# EAGLE schematic uart (EAGLE 7.6.0)
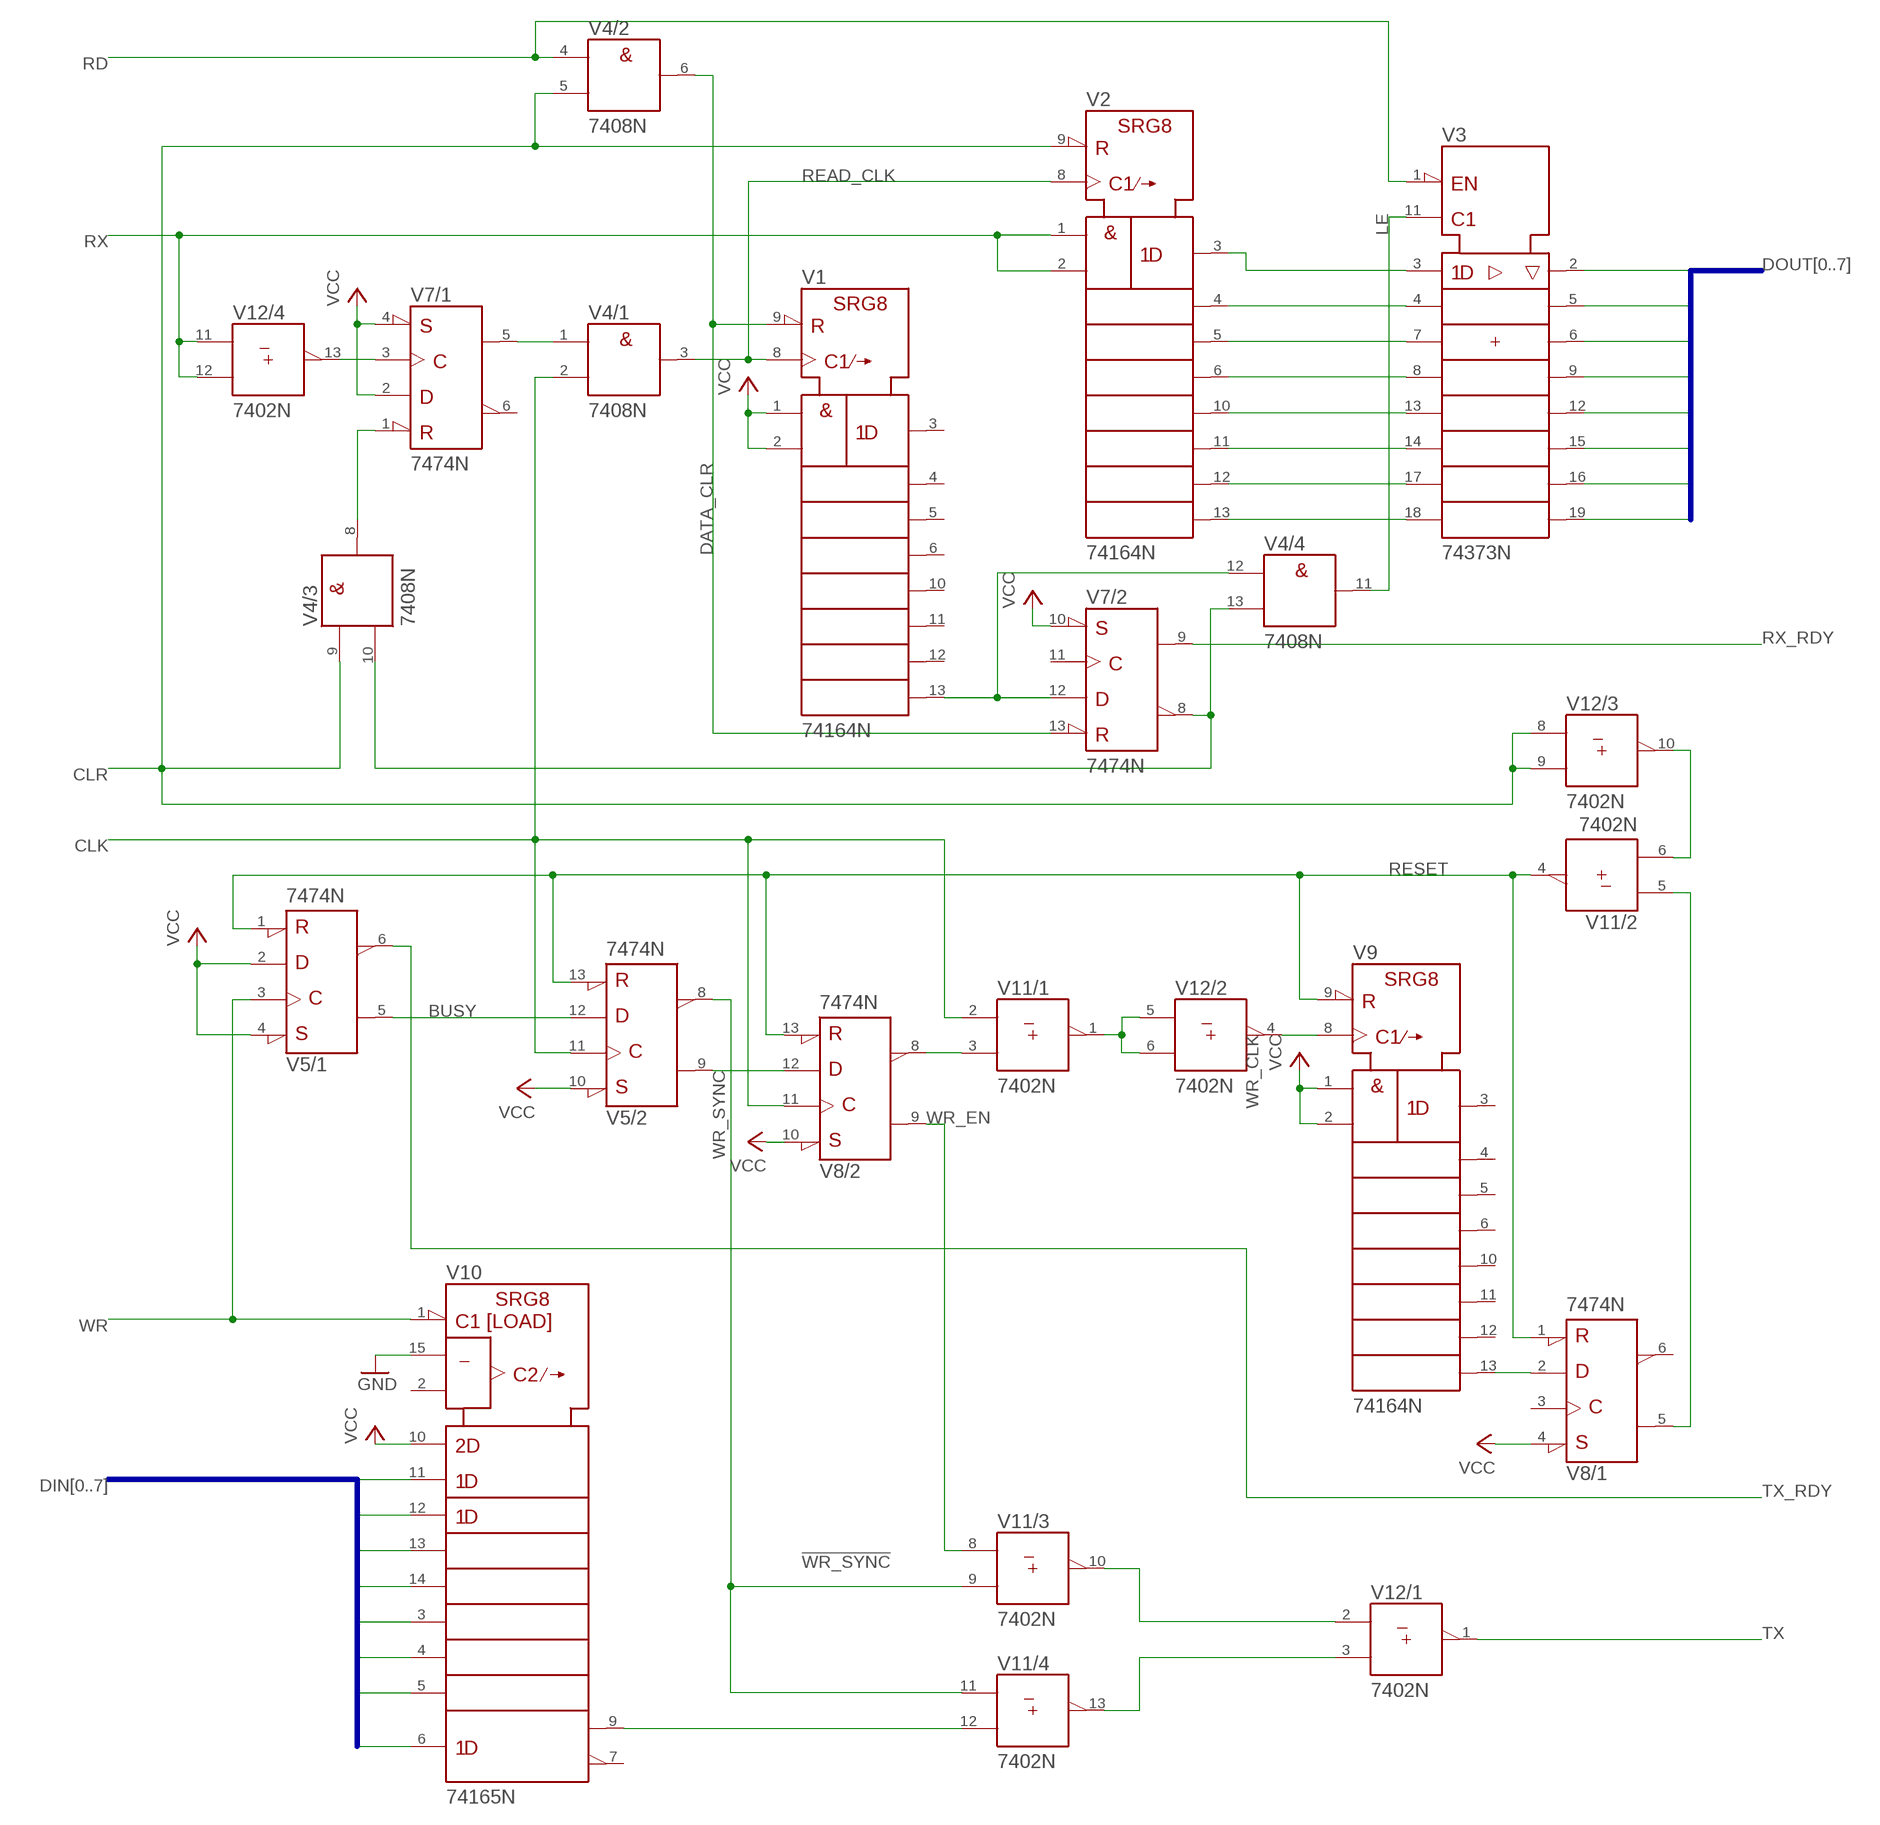
[diagram p0: schematic, sheet 1]

## Parts
V1  74164N  [DIL14]
V2  74164N  [DIL14]
V3  74373N  [DIL20]
V4  7408N  [DIL14]
V5  7474N  [DIL14]
V7  7474N  [DIL14]
V8  7474N  [DIL14]
V9  74164N  [DIL14]
V10  74165N  [DIL16]
V11  7402N  [DIL14]
V12  7402N  [DIL14]

## Nets
!TX_DATA_FIXED!: V11.13(/4:Y) V12.3(/1:B)
!WR_EN!: V8.8(/2:!Q) V11.3(/1:B)
!WR_SYNC!: V5.8(/2:!Q) V11.9(/3:B) V11.11(/4:A)
BUSY: V5.5(/1:Q) V5.12(/2:D)
CLK: V4.2(/1:B) V5.11(/2:CLK) V8.11(/2:CLK) V11.2(/1:A)
CLR: V2.9(!CLR) V4.5(/2:B) V4.9(/3:A) V12.8(/3:A) V12.9(/3:B)
DATA_CLR: V1.9(!CLR) V4.6(/2:Y) V7.13(/2:!CLR)
DIN0: V10.6(H)
DIN1: V10.5(G)
DIN2: V10.4(F)
DIN3: V10.3(E)
DIN4: V10.14(D)
DIN5: V10.13(C)
DIN6: V10.12(B)
DIN7: V10.11(A)
DONE: V8.5(/1:Q) V11.5(/2:A)
DOUT0: V3.19(8Q)
DOUT1: V3.16(7Q)
DOUT2: V3.15(6Q)
DOUT3: V3.12(5Q)
DOUT4: V3.9(4Q)
DOUT5: V3.6(3Q)
DOUT6: V3.5(2Q)
DOUT7: V3.2(1Q)
GND: V10.15(CLK_INH)
LE: V3.11(C) V4.11(/4:Y)
N$1: V2.11(QF) V3.14(6D)
N$2: V2.10(QE) V3.13(5D)
N$3: V2.6(QD) V3.8(4D)
N$4: V2.5(QC) V3.7(3D)
N$5: V2.4(QB) V3.4(2D)
N$6: V2.12(QG) V3.17(7D)
N$7: V2.13(QH) V3.18(8D)
N$8: V2.3(QA) V3.3(1D)
N$9: V1.13(QH) V4.12(/4:A) V7.12(/2:D)
N$10: V4.8(/3:Y) V7.1(/1:!CLR)
N$11: V4.10(/3:B) V4.13(/4:B) V7.8(/2:!Q)
N$12: V7.3(/1:CLK) V12.13(/4:Y)
N$13: V8.2(/1:D) V9.13(QH)
N$14: V11.1(/1:Y) V12.5(/2:A) V12.6(/2:B)
N$15: V11.6(/2:B) V12.10(/3:Y)
RD: V3.1(!OC) V4.4(/2:A)
READ_CLK: V1.8(CLK) V2.8(CLK) V4.3(/1:Y)
RESET: V5.1(/1:!CLR) V5.13(/2:!CLR) V8.1(/1:!CLR) V8.13(/2:!CLR) V9.9(!CLR) V11.4(/2:Y)
RX: V2.1(A) V2.2(B) V12.11(/4:A) V12.12(/4:B)
RX_RDY: V7.9(/2:Q)
START: V4.1(/1:A) V7.5(/1:Q)
START_BIT: V11.10(/3:Y) V12.2(/1:A)
TX: V12.1(/1:Y)
TX_DATA: V10.9(QH) V11.12(/4:B)
TX_RDY: V5.6(/1:!Q)
VCC: V1.1(A) V1.2(B) V5.2(/1:D) V5.4(/1:!PRE) V5.10(/2:!PRE) V7.2(/1:D) V7.4(/1:!PRE) V7.10(/2:!PRE) V8.4(/1:!PRE) V8.10(/2:!PRE) V9.1(A) V9.2(B) V10.10(SER)
WR: V5.3(/1:CLK) V10.1(SH/!LD)
WR_CLK: V9.8(CLK) V12.4(/2:Y)
WR_EN: V8.9(/2:Q) V11.8(/3:A)
WR_SYNC: V5.9(/2:Q) V8.12(/2:D)
Unconnected: V1.3(QA) V1.4(QB) V1.5(QC) V1.6(QD) V1.10(QE) V1.11(QF) V1.12(QG) V7.6(/1:!Q) V7.11(/2:CLK) V8.3(/1:CLK) V8.6(/1:!Q) V9.3(QA) V9.4(QB) V9.5(QC) V9.6(QD) V9.10(QE) V9.11(QF) V9.12(QG) V10.2(CLK) V10.7(!QH)

## Buses
DOUT[0..7]
DIN[0..7]

## Power pins joined to a net without a drawn wire
+UB: V1.14(+UB) V2.14(+UB) V3.20(+UB) V4.14(/+UB:+UB) V5.14(/+UB:+UB) V7.14(/+UB:+UB) V8.14(/+UB:+UB) V9.14(+UB) V10.16(+UB) V11.14(/+UB:+UB) V12.14(/+UB:+UB)
-UB: V1.7(-UB) V2.7(-UB) V3.10(-UB) V4.7(/-UB:-UB) V5.7(/-UB:-UB) V7.7(/-UB:-UB) V8.7(/-UB:-UB) V9.7(-UB) V10.8(-UB) V11.7(/-UB:-UB) V12.7(/-UB:-UB)

## Library data of the parts
V1 V2 V9 = 74ttl-din:74*164: 8-bit parallel out SHIFT REGISTER
V3 = 74ttl-din:74*373: Octal D type transparent LATCH, edge triggered
V4 = 74ttl-din:74*08: Quad 2-input AND gate
V5 V7 V8 = 74ttl-din:74*74: Dual D type positive edge triggered FLIP FLOP, preset and clear
V10 = 74ttl-din:74*165: 8-bit parallel load SHIFT REGISTER
V11 V12 = 74ttl-din:74*02: Quad 2-input NOR gate